# EAGLE schematic IOIO Unrouted - VRM (EAGLE 5.11)
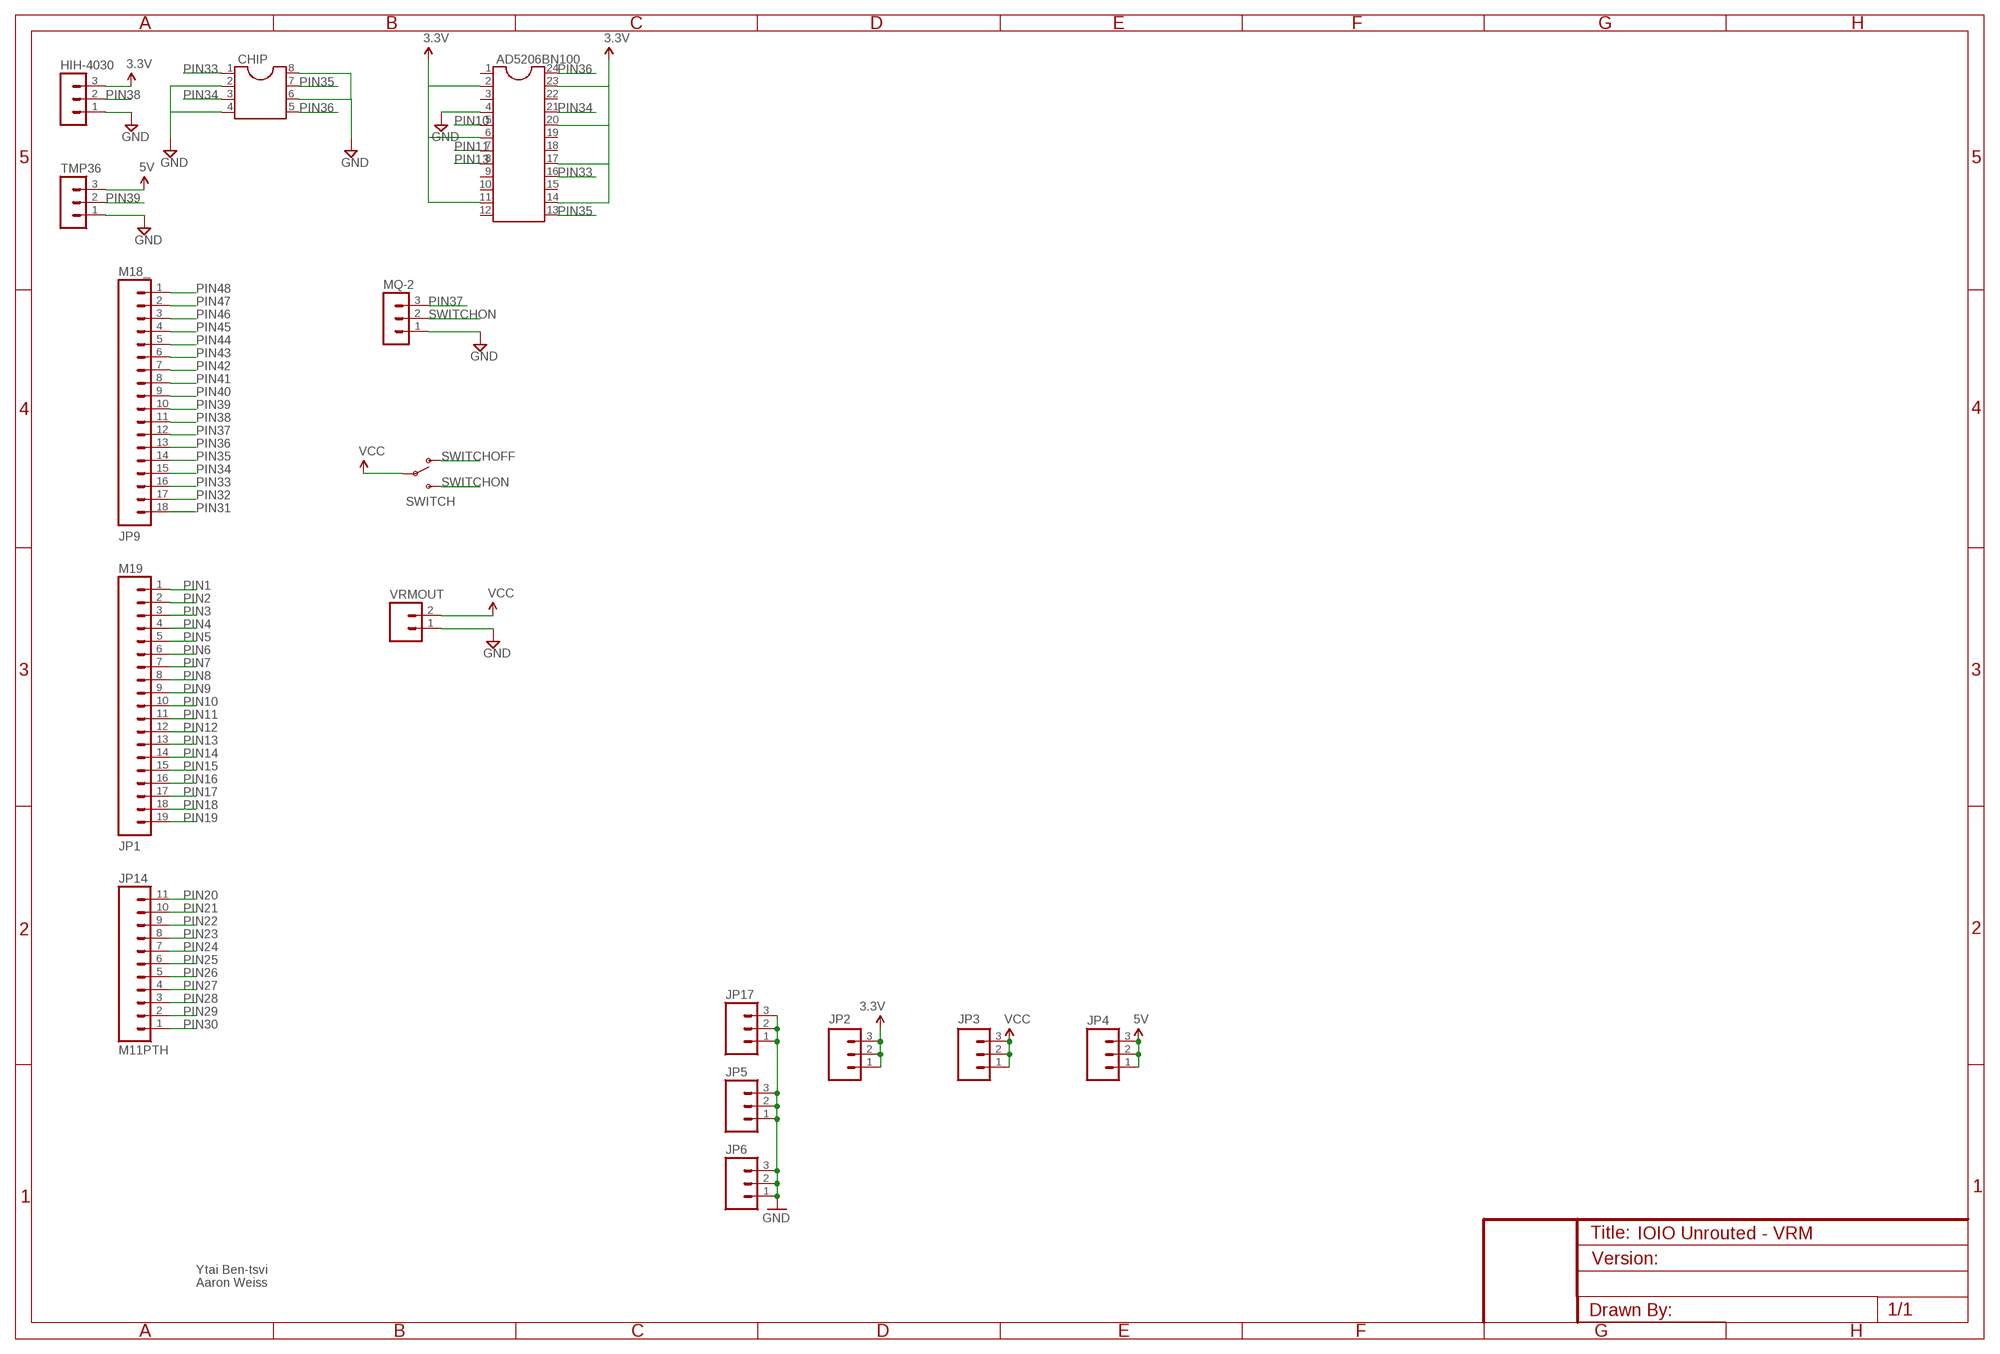
[diagram p0: schematic, sheet 1]

## Parts
AD5206BN100  DIL24-3  [DIL24-3]
CHIP  DIL8S  [SOCKET-08]
HIH-4030  MA03-1  [MA03-1]
JP1  M19  [1X19]
JP2  M03PTH  [1X03]
JP3  M03PTH  [1X03]
JP4  M03PTH  [1X03]
JP5  M03PTH  [1X03]
JP6  M03PTH  [1X03]
JP9  M18_  [1X18]
JP14  M11PTH  [1X11]
JP17  M03PTH  [1X03]
MQ-2  MA03-1  [MA03-1]
SWITCH  SWITCH-SPSTPTH_LOCK  [SWITCH-SPDT_LOCK.007S]
TMP36  MA03-1  [MA03-1]
VRMOUT  M02LOCK  [1X02_LOCK]

## Nets
3.3V: AD5206BN100.2 AD5206BN100.6 AD5206BN100.11 AD5206BN100.14 AD5206BN100.17 AD5206BN100.20 AD5206BN100.23 HIH-4030.3 JP2.1 JP2.2 JP2.3
5V: JP4.1 JP4.2 JP4.3 TMP36.3
GND: AD5206BN100.4 CHIP.2 CHIP.4 CHIP.6 CHIP.8 HIH-4030.1 JP5.1 JP5.2 JP5.3 JP6.1 JP6.2 JP6.3 JP17.1 JP17.2 JP17.3 MQ-2.1 TMP36.1 VRMOUT.1
PIN1: JP1.1
PIN2: JP1.2
PIN3: JP1.3
PIN4: JP1.4
PIN5: JP1.5
PIN6: JP1.6
PIN7: JP1.7
PIN8: JP1.8
PIN9: JP1.9
PIN10: AD5206BN100.5 JP1.10
PIN11: AD5206BN100.7 JP1.11
PIN12: JP1.12
PIN13: AD5206BN100.8 JP1.13
PIN14: JP1.14
PIN15: JP1.15
PIN16: JP1.16
PIN17: JP1.17
PIN18: JP1.18
PIN19: JP1.19
PIN20: JP14.11
PIN21: JP14.10
PIN22: JP14.9
PIN23: JP14.8
PIN24: JP14.7
PIN25: JP14.6
PIN26: JP14.5
PIN27: JP14.4
PIN28: JP14.3
PIN29: JP14.2
PIN30: JP14.1
PIN31: JP9.18
PIN32: JP9.17
PIN33: AD5206BN100.16 CHIP.1 JP9.16
PIN34: AD5206BN100.21 CHIP.3 JP9.15
PIN35: AD5206BN100.13 CHIP.7 JP9.14
PIN36: AD5206BN100.24 CHIP.5 JP9.13
PIN37: JP9.12 MQ-2.3
PIN38: HIH-4030.2 JP9.11
PIN39: JP9.10 TMP36.2
PIN40: JP9.9
PIN41: JP9.8
PIN42: JP9.7
PIN43: JP9.6
PIN44: JP9.5
PIN45: JP9.4
PIN46: JP9.3
PIN47: JP9.2
PIN48: JP9.1
SWITCHOFF: SWITCH.1(O)
SWITCHON: MQ-2.2 SWITCH.3(S)
VCC: JP3.1 JP3.2 JP3.3 SWITCH.2(P) VRMOUT.2
Unconnected: AD5206BN100.1 AD5206BN100.3 AD5206BN100.9 AD5206BN100.10 AD5206BN100.12 AD5206BN100.15 AD5206BN100.18 AD5206BN100.19 AD5206BN100.22

## Notes on the sheet
- Ytai Ben-tsvi
- Aaron Weiss

## Library data of the parts
AD5206BN100 = ic-package:DIL24: Dual In Line
CHIP = ic-package:DIL8: Dual In Line / Socket
HIH-4030 MQ-2 TMP36 = con-lstb:MA03-1: PIN HEADER; OC_FARNELL: unknown; OC_NEWARK: unknown
JP1 = SparkFun:M19
JP2-JP6 JP17 = SparkFun:M03: Header 3 Standard 3-pin 0.1" header. Use with straight break away headers (SKU : PRT-00116), right angle break away headers (PRT-00553), swiss pins (PRT-00743), machine pins (PRT-00117), and female headers (PRT-00115). Molex polarized connector foot print use with SKU : PRT-08232 with associated crimp pins and housings.
JP9 = SparkFun:M18
JP14 = SparkFun:M11: Header 11 Standard 11-pin 0.1" header. Use with straight break away headers (SKU : PRT-00116), right angle break away headers (PRT-00553), swiss pins (PRT-00743), machine pins (PRT-00117), and female headers (PRT-00115).
SWITCH = SparkFun:SWITCH-SPST: SPST Switch Simple slide switch. Spark Fun Electronics SKU : COM-00102
VRMOUT = SparkFun:M02: Header 2 Standard 2-pin 0.1" header. Use with straight break away headers (SKU : PRT-00116), right angle break away headers (PRT-00553), swiss pins (PRT-00743), machine pins (PRT-00117), and female headers (PRT-00115). Molex polarized connector foot print use with SKU : PRT-08233 with associated crimp pins and housings.